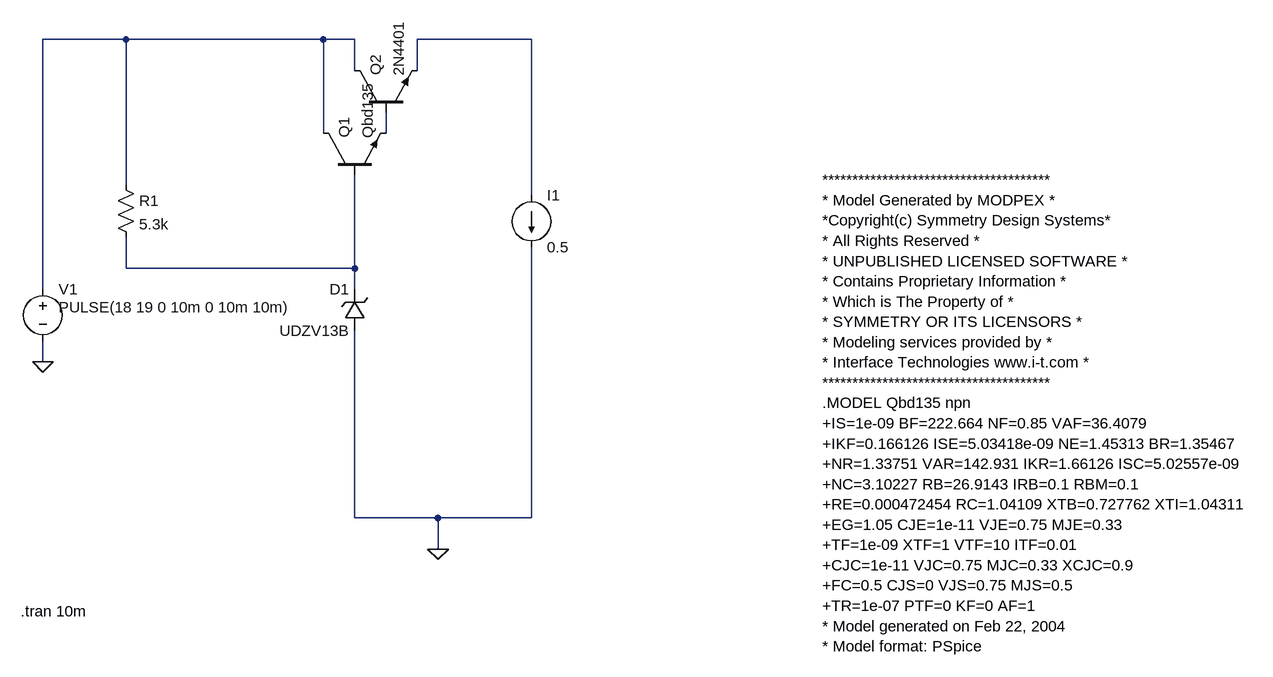
[diagram p0: schematic Draft2.asc]
Draft2.asc, the LTspice schematic file:
Version 4
SHEET 1 1952 736
WIRE 160 -160 32 -160
WIRE 464 -160 160 -160
WIRE 512 -160 464 -160
WIRE 784 -160 608 -160
WIRE 512 -112 512 -160
WIRE 608 -112 608 -160
WIRE 464 -16 464 -160
WIRE 560 -16 560 -48
WIRE 160 64 160 -160
WIRE 784 80 784 -160
WIRE 160 192 160 144
WIRE 512 192 512 48
WIRE 512 192 160 192
WIRE 32 224 32 -160
WIRE 512 224 512 192
WIRE 32 336 32 304
WIRE 512 576 512 288
WIRE 640 576 512 576
WIRE 784 576 784 160
WIRE 784 576 640 576
WIRE 640 624 640 576
FLAG 32 336 0
FLAG 640 624 0
SYMBOL res 144 48 R0
SYMATTR InstName R1
SYMATTR Value 5.3k
SYMBOL npn 464 48 R270
SYMATTR InstName Q1
SYMATTR Value Qbd135
SYMBOL npn 512 -48 R270
SYMATTR InstName Q2
SYMATTR Value 2N4401
SYMBOL zener 528 288 R180
WINDOW 0 24 64 Left 2
WINDOW 3 24 0 Left 2
SYMATTR InstName D1
SYMATTR Value UDZV13B
SYMBOL current 784 80 R0
WINDOW 123 0 0 Left 0
WINDOW 39 0 0 Left 0
SYMATTR InstName I1
SYMATTR Value 0.5
SYMBOL voltage 32 208 R0
WINDOW 3 24 44 Left 2
WINDOW 123 0 0 Left 0
WINDOW 39 0 0 Left 0
SYMATTR InstName V1
SYMATTR Value PULSE(18 19 0 10m 0 10m 10m)
TEXT 1232 56 Left 2 !**************************************\n* Model Generated by MODPEX *\n*Copyright(c) Symmetry Design Systems*\n* All Rights Reserved *\n* UNPUBLISHED LICENSED SOFTWARE *\n* Contains Proprietary Information *\n* Which is The Property of *\n* SYMMETRY OR ITS LICENSORS *\n* Modeling services provided by *\n* Interface Technologies www.i-t.com *\n**************************************\n.MODEL Qbd135 npn\n+IS=1e-09 BF=222.664 NF=0.85 VAF=36.4079\n+IKF=0.166126 ISE=5.03418e-09 NE=1.45313 BR=1.35467\n+NR=1.33751 VAR=142.931 IKR=1.66126 ISC=5.02557e-09\n+NC=3.10227 RB=26.9143 IRB=0.1 RBM=0.1\n+RE=0.000472454 RC=1.04109 XTB=0.727762 XTI=1.04311\n+EG=1.05 CJE=1e-11 VJE=0.75 MJE=0.33\n+TF=1e-09 XTF=1 VTF=10 ITF=0.01\n+CJC=1e-11 VJC=0.75 MJC=0.33 XCJC=0.9\n+FC=0.5 CJS=0 VJS=0.75 MJS=0.5\n+TR=1e-07 PTF=0 KF=0 AF=1\n* Model generated on Feb 22, 2004\n* Model format: PSpice
TEXT -2 720 Left 2 !.tran 10m

The netlist it stands for:
* Draft2.asc
R1 N001 N004 5.3k
Q1 N001 N004 N003 0 Qbd135
Q2 N001 N003 N002 0 2N4401
D1 0 N004 UDZV13B
I1 N002 0 0.5
V1 N001 0 PULSE(18 19 0 10m 0 10m 10m)
.model D D
.lib standard.dio
.model NPN NPN
.model PNP PNP
.lib standard.bjt
**************************************
* Model Generated by MODPEX *
*Copyright(c) Symmetry Design Systems*
* All Rights Reserved *
* UNPUBLISHED LICENSED SOFTWARE *
* Contains Proprietary Information *
* Which is The Property of *
* SYMMETRY OR ITS LICENSORS *
* Modeling services provided by *
* Interface Technologies www.i-t.com *
**************************************
.MODEL Qbd135 npn
+IS=1e-09 BF=222.664 NF=0.85 VAF=36.4079
+IKF=0.166126 ISE=5.03418e-09 NE=1.45313 BR=1.35467
+NR=1.33751 VAR=142.931 IKR=1.66126 ISC=5.02557e-09
+NC=3.10227 RB=26.9143 IRB=0.1 RBM=0.1
+RE=0.000472454 RC=1.04109 XTB=0.727762 XTI=1.04311
+EG=1.05 CJE=1e-11 VJE=0.75 MJE=0.33
+TF=1e-09 XTF=1 VTF=10 ITF=0.01
+CJC=1e-11 VJC=0.75 MJC=0.33 XCJC=0.9
+FC=0.5 CJS=0 VJS=0.75 MJS=0.5
+TR=1e-07 PTF=0 KF=0 AF=1
* Model generated on Feb 22, 2004
* Model format: PSpice
.tran 10m
.backanno
.end